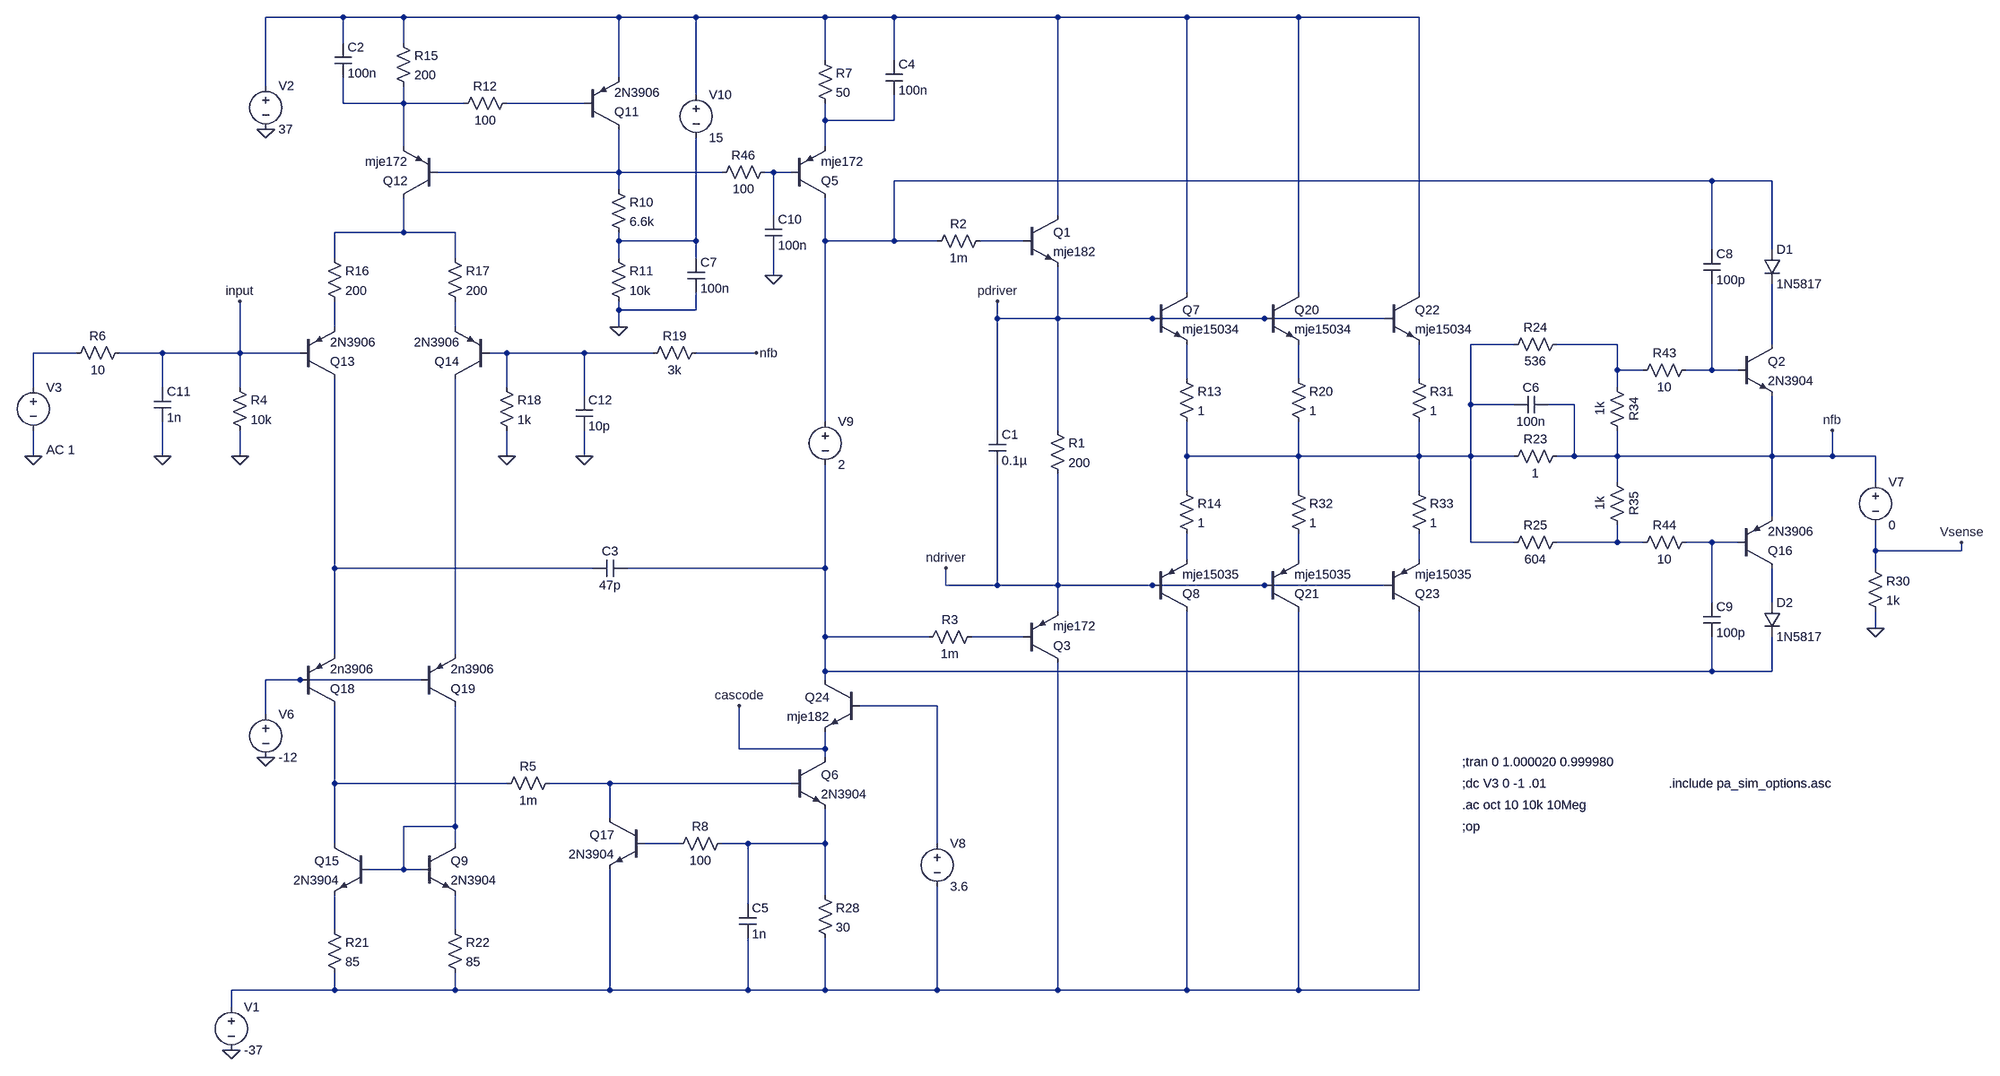
[diagram p0: schematic pa_with_protection.asc]
pa_with_protection.asc, the LTspice schematic file:
Version 4
SHEET 1 4112 1440
WIRE 1040 -624 896 -624
WIRE 1152 -624 1040 -624
WIRE 1552 -624 1152 -624
WIRE 1696 -624 1552 -624
WIRE 1936 -624 1696 -624
WIRE 2064 -624 1936 -624
WIRE 2368 -624 2064 -624
WIRE 2608 -624 2368 -624
WIRE 2816 -624 2608 -624
WIRE 3040 -624 2816 -624
WIRE 1040 -576 1040 -624
WIRE 1152 -576 1152 -624
WIRE 1936 -544 1936 -624
WIRE 2064 -544 2064 -624
WIRE 1552 -512 1552 -624
WIRE 896 -496 896 -624
WIRE 1696 -480 1696 -624
WIRE 1040 -464 1040 -512
WIRE 1152 -464 1152 -496
WIRE 1152 -464 1040 -464
WIRE 1264 -464 1152 -464
WIRE 1488 -464 1344 -464
WIRE 1936 -432 1936 -464
WIRE 2064 -432 2064 -480
WIRE 2064 -432 1936 -432
WIRE 1152 -384 1152 -464
WIRE 1936 -384 1936 -432
WIRE 1552 -336 1552 -416
WIRE 1552 -336 1216 -336
WIRE 1744 -336 1552 -336
WIRE 1840 -336 1824 -336
WIRE 1872 -336 1840 -336
WIRE 3584 -320 2064 -320
WIRE 3696 -320 3584 -320
WIRE 1552 -304 1552 -336
WIRE 1840 -256 1840 -336
WIRE 2368 -256 2368 -624
WIRE 1152 -224 1152 -288
WIRE 1152 -224 1024 -224
WIRE 1248 -224 1152 -224
WIRE 1552 -208 1552 -224
WIRE 1696 -208 1696 -400
WIRE 1696 -208 1552 -208
WIRE 1936 -208 1936 -288
WIRE 2064 -208 2064 -320
WIRE 2064 -208 1936 -208
WIRE 2144 -208 2064 -208
WIRE 2304 -208 2224 -208
WIRE 3584 -192 3584 -320
WIRE 3696 -192 3696 -320
WIRE 1024 -176 1024 -224
WIRE 1248 -176 1248 -224
WIRE 1552 -176 1552 -208
WIRE 1696 -176 1696 -208
WIRE 1840 -144 1840 -192
WIRE 2608 -112 2608 -624
WIRE 2816 -112 2816 -624
WIRE 3040 -112 3040 -624
WIRE 1552 -80 1552 -96
WIRE 1696 -80 1696 -112
WIRE 1696 -80 1552 -80
WIRE 2256 -64 2256 -96
WIRE 2368 -64 2368 -160
WIRE 2368 -64 2256 -64
WIRE 2544 -64 2368 -64
WIRE 2752 -64 2544 -64
WIRE 2976 -64 2752 -64
WIRE 1024 -48 1024 -96
WIRE 1248 -48 1248 -96
WIRE 1552 -48 1552 -80
WIRE 3216 -16 3136 -16
WIRE 3408 -16 3296 -16
WIRE 3696 -16 3696 -128
WIRE 544 0 464 0
WIRE 704 0 624 0
WIRE 848 0 848 -96
WIRE 848 0 704 0
WIRE 960 0 848 0
WIRE 1344 0 1312 0
WIRE 1488 0 1344 0
WIRE 1616 0 1488 0
WIRE 1808 0 1696 0
WIRE 3408 32 3408 -16
WIRE 3456 32 3408 32
WIRE 3584 32 3584 -128
WIRE 3584 32 3536 32
WIRE 3632 32 3584 32
WIRE 2608 48 2608 -16
WIRE 2816 48 2816 -16
WIRE 3040 48 3040 -16
WIRE 464 64 464 0
WIRE 704 64 704 0
WIRE 848 64 848 0
WIRE 1344 64 1344 0
WIRE 3408 64 3408 32
WIRE 1488 80 1488 0
WIRE 3136 96 3136 -16
WIRE 3216 96 3136 96
WIRE 3328 96 3280 96
WIRE 1936 128 1936 -208
WIRE 2256 144 2256 -64
WIRE 2368 144 2368 -64
WIRE 464 192 464 144
WIRE 704 192 704 128
WIRE 848 192 848 144
WIRE 1344 192 1344 144
WIRE 1488 192 1488 144
WIRE 2608 192 2608 128
WIRE 2816 192 2816 128
WIRE 2816 192 2608 192
WIRE 3040 192 3040 128
WIRE 3040 192 2816 192
WIRE 3136 192 3136 96
WIRE 3136 192 3040 192
WIRE 3216 192 3136 192
WIRE 3328 192 3328 96
WIRE 3328 192 3296 192
WIRE 3408 192 3408 144
WIRE 3408 192 3328 192
WIRE 3696 192 3696 80
WIRE 3696 192 3408 192
WIRE 3808 192 3808 144
WIRE 3808 192 3696 192
WIRE 3888 192 3808 192
WIRE 3408 240 3408 192
WIRE 3888 240 3888 192
WIRE 2608 256 2608 192
WIRE 2816 256 2816 192
WIRE 3040 256 3040 192
WIRE 3696 304 3696 192
WIRE 3136 352 3136 192
WIRE 3216 352 3136 352
WIRE 3408 352 3408 320
WIRE 3408 352 3296 352
WIRE 3456 352 3408 352
WIRE 3584 352 3536 352
WIRE 3632 352 3584 352
WIRE 3888 368 3888 320
WIRE 4048 368 4048 352
WIRE 4048 368 3888 368
WIRE 2608 384 2608 336
WIRE 2816 384 2816 336
WIRE 3040 384 3040 336
WIRE 1024 400 1024 48
WIRE 1504 400 1024 400
WIRE 1936 400 1936 208
WIRE 1936 400 1568 400
WIRE 3888 400 3888 368
WIRE 2160 432 2160 400
WIRE 2256 432 2256 208
WIRE 2256 432 2160 432
WIRE 2368 432 2368 224
WIRE 2368 432 2256 432
WIRE 2544 432 2368 432
WIRE 2752 432 2544 432
WIRE 2976 432 2752 432
WIRE 3584 464 3584 352
WIRE 3696 464 3696 400
WIRE 2368 480 2368 432
WIRE 3888 512 3888 480
WIRE 1936 528 1936 400
WIRE 2128 528 1936 528
WIRE 2304 528 2208 528
WIRE 1024 560 1024 400
WIRE 1248 560 1248 48
WIRE 1936 592 1936 528
WIRE 3584 592 3584 528
WIRE 3584 592 1936 592
WIRE 3696 592 3696 528
WIRE 3696 592 3584 592
WIRE 960 608 896 608
WIRE 1184 608 960 608
WIRE 1936 608 1936 592
WIRE 2144 656 2000 656
WIRE 896 672 896 608
WIRE 1776 736 1776 656
WIRE 1936 736 1936 704
WIRE 1936 736 1776 736
WIRE 1936 752 1936 736
WIRE 1024 800 1024 656
WIRE 1344 800 1024 800
WIRE 1536 800 1424 800
WIRE 1872 800 1536 800
WIRE 1536 864 1536 800
WIRE 1248 880 1248 656
WIRE 1248 880 1152 880
WIRE 1024 912 1024 800
WIRE 1248 912 1248 880
WIRE 1664 912 1600 912
WIRE 1792 912 1744 912
WIRE 1936 912 1936 848
WIRE 1936 912 1792 912
WIRE 2144 912 2144 656
WIRE 1152 960 1152 880
WIRE 1152 960 1088 960
WIRE 1184 960 1152 960
WIRE 1936 1008 1936 912
WIRE 1792 1024 1792 912
WIRE 1024 1072 1024 1008
WIRE 1248 1072 1248 1008
WIRE 1024 1184 1024 1152
WIRE 1024 1184 832 1184
WIRE 1248 1184 1248 1152
WIRE 1248 1184 1024 1184
WIRE 1536 1184 1536 960
WIRE 1536 1184 1248 1184
WIRE 1792 1184 1792 1088
WIRE 1792 1184 1536 1184
WIRE 1936 1184 1936 1088
WIRE 1936 1184 1792 1184
WIRE 2144 1184 2144 992
WIRE 2144 1184 1936 1184
WIRE 2368 1184 2368 576
WIRE 2368 1184 2144 1184
WIRE 2608 1184 2608 480
WIRE 2608 1184 2368 1184
WIRE 2816 1184 2816 480
WIRE 2816 1184 2608 1184
WIRE 3040 1184 3040 480
WIRE 3040 1184 2816 1184
WIRE 832 1216 832 1184
FLAG 896 -416 0
FLAG 832 1296 0
FLAG 1552 -48 0
FLAG 1344 192 0
FLAG 1808 0 nfb
FLAG 3808 144 nfb
FLAG 3888 512 0
FLAG 896 752 0
FLAG 4048 352 Vsense
FLAG 848 192 0
FLAG 464 192 0
FLAG 1776 656 cascode
FLAG 2256 -96 pdriver
FLAG 2160 400 ndriver
FLAG 848 -96 input
FLAG 1840 -144 0
FLAG 704 192 0
FLAG 1488 192 0
SYMBOL voltage 832 1200 R0
WINDOW 123 0 0 Left 0
WINDOW 39 0 0 Left 0
SYMATTR InstName V1
SYMATTR Value -37
SYMBOL voltage 896 -512 R0
WINDOW 123 0 0 Left 0
WINDOW 39 0 0 Left 0
SYMATTR InstName V2
SYMATTR Value 37
SYMBOL npn 2544 -112 R0
SYMATTR InstName Q7
SYMATTR Value mje15034
SYMBOL pnp 2544 480 M180
SYMATTR InstName Q8
SYMATTR Value mje15035
SYMBOL res 2592 32 R0
SYMATTR InstName R13
SYMATTR Value 1
SYMBOL res 2592 240 R0
SYMATTR InstName R14
SYMATTR Value 1
SYMBOL npn 1184 912 R0
SYMATTR InstName Q9
SYMATTR Value 2N3904
SYMBOL npn 2304 -256 R0
SYMATTR InstName Q1
SYMATTR Value mje182
SYMBOL pnp 2304 576 M180
SYMATTR InstName Q3
SYMATTR Value mje172
SYMBOL res 2352 128 R0
SYMATTR InstName R1
SYMATTR Value 200
SYMBOL cap 2240 144 R0
SYMATTR InstName C1
SYMATTR Value 0.1µ
SYMBOL res 2128 -192 R270
WINDOW 0 32 56 VTop 0
WINDOW 3 0 56 VBottom 0
SYMATTR InstName R2
SYMATTR Value 1m
SYMBOL res 2112 544 R270
WINDOW 0 32 56 VTop 0
WINDOW 3 0 56 VBottom 0
SYMATTR InstName R3
SYMATTR Value 1m
SYMBOL pnp 1872 -288 M180
SYMATTR InstName Q5
SYMATTR Value mje172
SYMBOL res 1920 -560 R0
SYMATTR InstName R7
SYMATTR Value 50
SYMBOL npn 1872 752 R0
SYMATTR InstName Q6
SYMATTR Value 2N3904
SYMBOL cap 1504 416 R270
WINDOW 0 32 32 VTop 0
WINDOW 3 0 32 VBottom 0
SYMATTR InstName C3
SYMATTR Value 47p
SYMBOL res 1536 -320 R0
SYMATTR InstName R10
SYMATTR Value 6.6k
SYMBOL res 1536 -192 R0
SYMATTR InstName R11
SYMATTR Value 10k
SYMBOL pnp 1488 -416 M180
SYMATTR InstName Q11
SYMATTR Value 2N3906
SYMBOL res 1136 -592 R0
SYMATTR InstName R15
SYMATTR Value 200
SYMBOL pnp 1216 -288 R180
SYMATTR InstName Q12
SYMATTR Value mje172
SYMBOL res 1008 -192 R0
SYMATTR InstName R16
SYMATTR Value 200
SYMBOL res 1232 -192 R0
SYMATTR InstName R17
SYMATTR Value 200
SYMBOL pnp 960 48 M180
SYMATTR InstName Q13
SYMATTR Value 2N3906
SYMBOL pnp 1312 48 R180
SYMATTR InstName Q14
SYMATTR Value 2N3906
SYMBOL res 1328 48 R0
SYMATTR InstName R18
SYMATTR Value 1k
SYMBOL res 1600 16 R270
WINDOW 0 32 56 VTop 0
WINDOW 3 0 56 VBottom 0
SYMATTR InstName R19
SYMATTR Value 3k
SYMBOL npn 1088 912 M0
SYMATTR InstName Q15
SYMATTR Value 2N3904
SYMBOL res 1008 1056 R0
SYMATTR InstName R21
SYMATTR Value 85
SYMBOL res 1232 1056 R0
SYMATTR InstName R22
SYMATTR Value 85
SYMBOL res 3200 0 R270
WINDOW 0 32 56 VTop 0
WINDOW 3 0 56 VBottom 0
SYMATTR InstName R24
SYMATTR Value 536
SYMBOL res 3200 368 R270
WINDOW 0 32 56 VTop 0
WINDOW 3 0 56 VBottom 0
SYMATTR InstName R25
SYMATTR Value 604
SYMBOL npn 3632 -16 R0
SYMATTR InstName Q2
SYMATTR Value 2N3904
SYMBOL pnp 3632 400 M180
SYMATTR InstName Q16
SYMATTR Value 2N3906
SYMBOL diode 3680 -192 R0
SYMATTR InstName D1
SYMATTR Value 1N5817
SYMBOL res 1920 992 R0
SYMATTR InstName R28
SYMATTR Value 30
SYMBOL npn 1600 864 M0
SYMATTR InstName Q17
SYMATTR Value 2N3904
SYMBOL res 3872 384 R0
SYMATTR InstName R30
SYMATTR Value 1k
SYMBOL pnp 960 656 M180
SYMATTR InstName Q18
SYMATTR Value 2n3906
SYMBOL pnp 1184 656 M180
SYMATTR InstName Q19
SYMATTR Value 2n3906
SYMBOL voltage 896 656 R0
WINDOW 123 0 0 Left 0
WINDOW 39 0 0 Left 0
SYMATTR InstName V6
SYMATTR Value -12
SYMBOL npn 2752 -112 R0
SYMATTR InstName Q20
SYMATTR Value mje15034
SYMBOL pnp 2752 480 M180
SYMATTR InstName Q21
SYMATTR Value mje15035
SYMBOL npn 2976 -112 R0
SYMATTR InstName Q22
SYMATTR Value mje15034
SYMBOL pnp 2976 480 M180
SYMATTR InstName Q23
SYMATTR Value mje15035
SYMBOL res 2800 32 R0
SYMATTR InstName R20
SYMATTR Value 1
SYMBOL res 3024 32 R0
SYMATTR InstName R31
SYMATTR Value 1
SYMBOL res 2800 240 R0
SYMATTR InstName R32
SYMATTR Value 1
SYMBOL res 3024 240 R0
SYMATTR InstName R33
SYMATTR Value 1
SYMBOL res 3200 208 R270
WINDOW 0 32 56 VTop 0
WINDOW 3 0 56 VBottom 0
SYMATTR InstName R23
SYMATTR Value 1
SYMBOL voltage 3888 224 R0
WINDOW 123 0 0 Left 0
WINDOW 39 0 0 Left 0
SYMATTR InstName V7
SYMATTR Value 0
SYMBOL res 3392 48 R0
WINDOW 0 32 56 VTop 0
WINDOW 3 0 56 VBottom 0
SYMATTR InstName R34
SYMATTR Value 1k
SYMBOL res 3392 224 R0
WINDOW 0 32 56 VTop 0
WINDOW 3 0 56 VBottom 0
SYMATTR InstName R35
SYMATTR Value 1k
SYMBOL npn 2000 608 M0
SYMATTR InstName Q24
SYMATTR Value mje182
SYMBOL cap 3568 464 R0
SYMATTR InstName C9
SYMATTR Value 100p
SYMBOL cap 3568 -192 R0
SYMATTR InstName C8
SYMATTR Value 100p
SYMBOL res 3440 48 R270
WINDOW 0 32 56 VTop 0
WINDOW 3 0 56 VBottom 0
SYMATTR InstName R43
SYMATTR Value 10
SYMBOL res 3440 368 R270
WINDOW 0 32 56 VTop 0
WINDOW 3 0 56 VBottom 0
SYMATTR InstName R44
SYMATTR Value 10
SYMBOL res 1728 -320 R270
WINDOW 0 32 56 VTop 0
WINDOW 3 0 56 VBottom 0
SYMATTR InstName R46
SYMATTR Value 100
SYMBOL res 1248 -448 R270
WINDOW 0 32 56 VTop 0
WINDOW 3 0 56 VBottom 0
SYMATTR InstName R12
SYMATTR Value 100
SYMBOL cap 1776 1024 R0
SYMATTR InstName C5
SYMATTR Value 1n
SYMBOL res 1648 928 R270
WINDOW 0 32 56 VTop 0
WINDOW 3 0 56 VBottom 0
SYMATTR InstName R8
SYMATTR Value 100
SYMBOL voltage 2144 896 R0
WINDOW 123 0 0 Left 0
WINDOW 39 0 0 Left 0
SYMATTR InstName V8
SYMATTR Value 3.6
SYMBOL voltage 1936 112 R0
WINDOW 123 0 0 Left 0
WINDOW 39 0 0 Left 0
SYMATTR InstName V9
SYMATTR Value 2
SYMBOL res 832 48 R0
SYMATTR InstName R4
SYMATTR Value 10k
SYMBOL voltage 1696 -496 R0
WINDOW 123 0 0 Left 0
WINDOW 39 0 0 Left 0
SYMATTR InstName V10
SYMATTR Value 15
SYMBOL diode 3680 464 R0
SYMATTR InstName D2
SYMATTR Value 1N5817
SYMBOL voltage 464 48 R0
WINDOW 123 24 132 Left 0
WINDOW 39 0 0 Left 0
WINDOW 3 24 104 Invisible 0
SYMATTR Value2 AC 1
SYMATTR InstName V3
SYMATTR Value PULSE(-0.63 0.63 1s 1n 1n 1u 10u 1)
SYMBOL res 1328 816 R270
WINDOW 0 32 56 VTop 0
WINDOW 3 0 56 VBottom 0
SYMATTR InstName R5
SYMATTR Value 1m
SYMBOL cap 1024 -576 R0
SYMATTR InstName C2
SYMATTR Value 100n
SYMBOL cap 2048 -544 R0
SYMATTR InstName C4
SYMATTR Value 100n
SYMBOL cap 3216 112 R270
WINDOW 0 32 32 VTop 0
WINDOW 3 0 32 VBottom 0
SYMATTR InstName C6
SYMATTR Value 100n
SYMBOL cap 1680 -176 R0
SYMATTR InstName C7
SYMATTR Value 100n
SYMBOL cap 1824 -256 R0
SYMATTR InstName C10
SYMATTR Value 100n
SYMBOL res 528 16 R270
WINDOW 0 32 56 VTop 0
WINDOW 3 0 56 VBottom 0
SYMATTR InstName R6
SYMATTR Value 10
SYMBOL cap 688 64 R0
SYMATTR InstName C11
SYMATTR Value 1n
SYMBOL cap 1472 80 R0
SYMATTR InstName C12
SYMATTR Value 10p
TEXT 3120 880 Left 0 !;op
TEXT 3120 840 Left 0 !.ac oct 10 10k 10Meg
TEXT 3120 760 Left 0 !;tran 0 1.000020 0.999980
TEXT 3120 800 Left 0 !;dc V3 0 -1 .01
TEXT 3504 800 Left 0 !.include pa_sim_options.asc

The netlist it stands for:
* pa_with_protection.asc
V1 N041 0 -37
V2 N001 0 37
Q7 N001 pdriver N019 0 mje15034
Q8 N041 ndriver N024 0 mje15035
R13 N019 N013 1
R14 N013 N024 1
Q9 N036 N036 N040 0 2N3904
Q1 N001 N010 pdriver 0 mje182
Q3 N041 N030 ndriver 0 mje172
R1 pdriver ndriver 200
C1 pdriver ndriver 0.1µ
R2 N007 N010 1m
R3 N028 N030 1m
Q5 N007 N006 N004 0 mje172
R7 N001 N004 50
Q6 cascode N035 N038 0 2N3904
C3 N027 N028 47p
R10 N005 N009 6.6k
R11 N009 0 10k
Q11 N005 N003 N001 0 2N3906
R15 N001 N002 200
Q12 N008 N005 N002 0 mje172
R16 N008 N011 200
R17 N008 N012 200
Q13 N027 input N011 0 2N3906
Q14 N031 N017 N012 0 2N3906
R18 N017 0 1k
R19 N017 nfb 3k
Q15 N034 N036 N039 0 2N3904
R21 N039 N041 85
R22 N040 N041 85
R24 N013 N014 536
R25 N013 N022 604
Q2 N015 N018 nfb 0 2N3904
Q16 N029 N023 nfb 0 2N3906
D1 N007 N015 1N5817
R28 N038 N041 30
Q17 N035 N037 N041 0 2N3904
R30 Vsense 0 1k
Q18 N034 N032 N027 0 2n3906
Q19 N036 N032 N031 0 2n3906
V6 N032 0 -12
Q20 N001 pdriver N020 0 mje15034
Q21 N041 ndriver N025 0 mje15035
Q22 N001 pdriver N021 0 mje15034
Q23 N041 ndriver N026 0 mje15035
R20 N020 N013 1
R31 N021 N013 1
R32 N013 N025 1
R33 N013 N026 1
R23 N013 nfb 1
V7 nfb Vsense 0
R34 N014 nfb 1k
R35 nfb N022 1k
Q24 N028 N033 cascode 0 mje182
C9 N023 N028 100p
C8 N007 N018 100p
R43 N014 N018 10
R44 N022 N023 10
R46 N005 N006 100
R12 N002 N003 100
C5 N038 N041 1n
R8 N037 N038 100
V8 N033 N041 3.6
V9 N007 N028 2
R4 input 0 10k
V10 N001 N009 15
D2 N029 N028 1N5817
V3 N016 0 PULSE(-0.63 0.63 1s 1n 1n 1u 10u 1) AC 1
R5 N034 N035 1m
C2 N001 N002 100n
C4 N001 N004 100n
C6 N013 nfb 100n
C7 N009 0 100n
C10 N006 0 100n
R6 N016 input 10
C11 input 0 1n
C12 N017 0 10p
.model D D
.lib standard.dio
.model NPN NPN
.model PNP PNP
.lib standard.bjt
;op
.ac oct 10 10k 10Meg
;tran 0 1.000020 0.999980
;dc V3 0 -1 .01
.include pa_sim_options.asc
.backanno
.end